# Altium schematic sheet SFP.SchDoc: Metlino
size 420 x 297 mm; CheckedBy: P.Kulik,T.Przywozki,W.Ruclo; Author: G.Kasprowicz; CompanyName: WUT ISE; DrawnBy: G.Kasprowicz; Organization: WUT ISE; Address1: PW ISE; Address2: Nowowiejska 15/19 00-665 Warsaw; Address3: gkasprow@gmail.com; DocumentNumber: 16; Revision: 2; SheetNumber: 16; SheetTotal: 29; ModifiedBy: -; CheckedDate: -; Title2: SFP; DivGrp: WUT ISE; Designer: G.Kasprowicz; ModifiedDate: -; ProjectName: Sensor Box
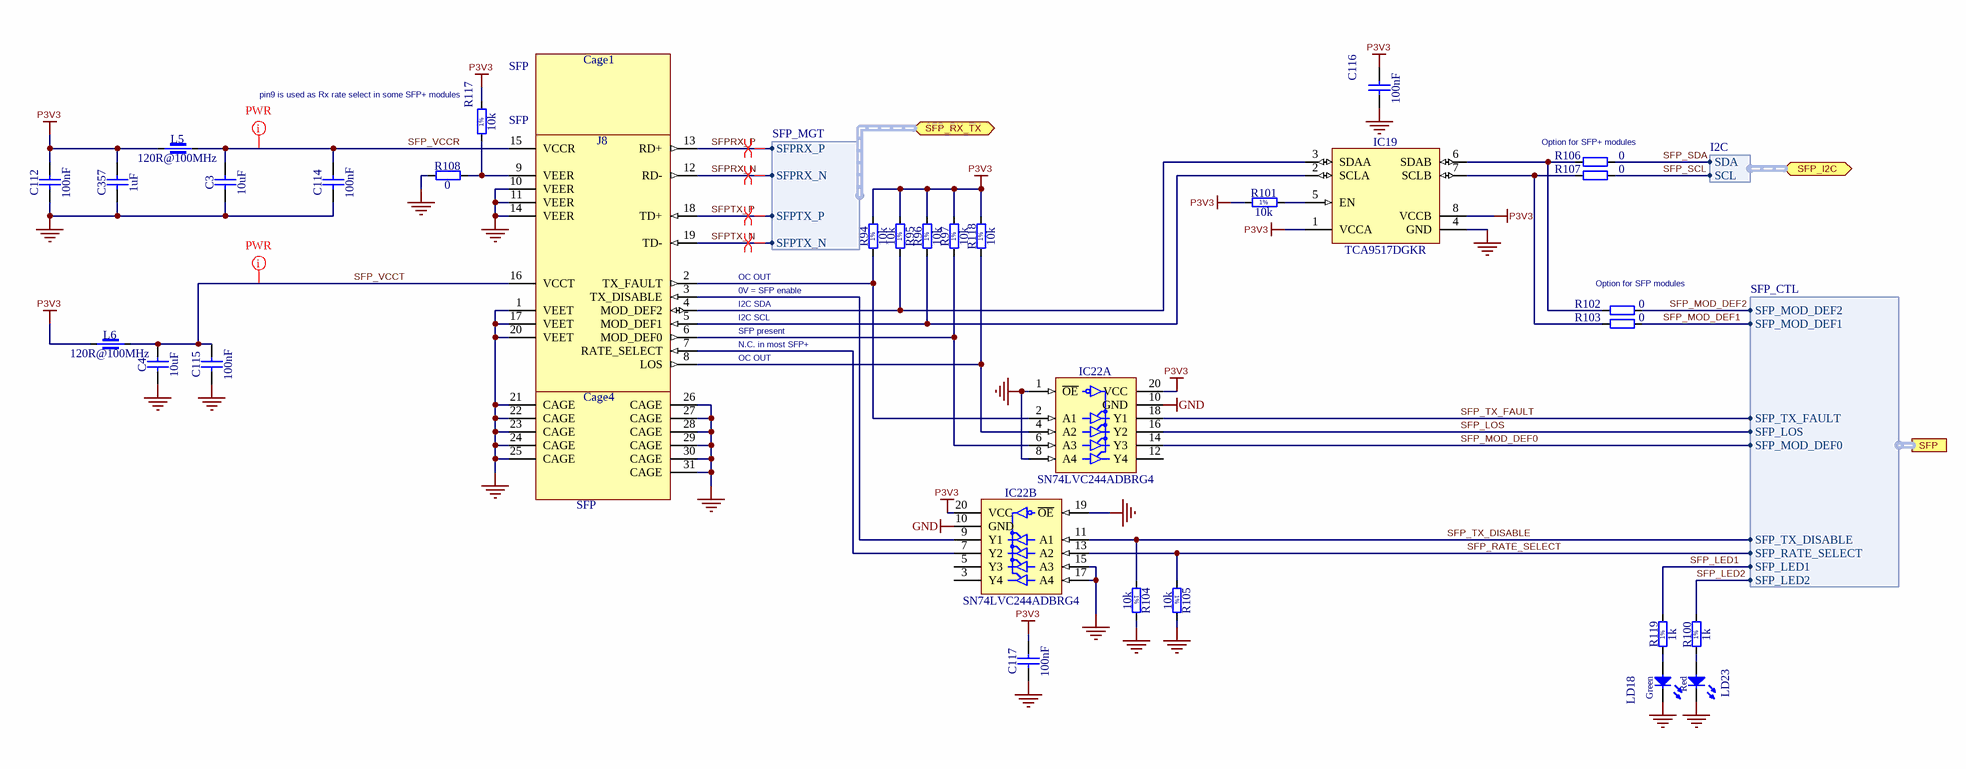
[diagram p0: SFP.SchDoc]

## Parts
C3  10uF  [CAPC1608X87N]
C4  10uF  [CAPC1608X87N]
C112  100nF  [CAPC0603X33N]
C114  100nF  [CAPC0603X33N]
C115  100nF  [CAPC0603X33N]
C116  100nF  [CAPC0603X33N]
C117  100nF  [CAPC0603X33N]
C357  1uF  [CAPC1005X55N]
Cage1  SFP  [TYCO_6367035-1]
Cage4  SFP  [TYCO_6367034-1]
IC19  TCA9517DGKR  [SOP65P490X110-8N]
IC22  SN74LVC244ADBRG4  [SOP65P780X200-20N]  (parts A,B of 2)
J8  SFP  [TYCO_1367073-1]
L5  120R@100MHz  [INDC1608X65N]
L6  120R@100MHz  [INDC1608X65N]
LD18  Green  [LED_AVAGO_HSME-C120]
LD23  Red  [LED_AVAGO_HSMC-C120]
R94  10k  [RESC1005X40N]
R95  10k  [RESC1005X40N]
R96  10k  [RESC1005X40N]
R97  10k  [RESC1005X40N]
R100  1k  [RESC1005X40N]
R101  10k  [RESC1005X40N]
R102  0  [RESC1005X40N]
R103  0  [RESC1005X40N]
R104  10k  [RESC1005X40N]
R105  10k  [RESC1005X40N]
R106  0  [RESC1005X40N]
R107  0  [RESC1005X40N]
R108  0  [RESC1005X40N]
R117  10k  [RESC1005X40N]
R118  10k  [RESC1005X40N]
R119  1k  [RESC1005X40N]

## Ports
SFP (harness SFP_CTL), SFP_I2C (bidir, harness I2C), SFP_RX_TX (bidir, harness SFP_MGT)

## Harnesses
SFP_MGT: SFPRX_P, SFPRX_N, SFPTX_P, SFPTX_N
SFP_CTL: SFP_MOD_DEF2, SFP_MOD_DEF1, SFP_TX_FAULT, SFP_LOS, SFP_MOD_DEF0, SFP_TX_DISABLE, SFP_RATE_SELECT, SFP_LED1, SFP_LED2
I2C: SCL, SDA

## Nets
GND: C3.1 C4.1 C112.1 C114.1 C115.1 C116.1 C117.1 C357.1 Cage4.21(CAGE) Cage4.22(CAGE) Cage4.23(CAGE) Cage4.24(CAGE) Cage4.25(CAGE) Cage4.26(CAGE) Cage4.27(CAGE) Cage4.28(CAGE) Cage4.29(CAGE) Cage4.30(CAGE) Cage4.31(CAGE) IC19.4(GND) IC22.1(~{OE}) IC22.8(A4) IC22.10(GND) IC22.15(A3) IC22.17(A4) IC22.19(~{OE}) J8.1(VEET) J8.10(VEER) J8.11(VEER) J8.14(VEER) J8.17(VEET) J8.20(VEET) LD18.1(C) LD23.1(C) R104.2 R105.2 R108.1
P3V3: C112.2 C116.2 C117.2 C357.2 IC19.1(VCCA) IC19.8(VCCB) IC22.20(VCC) L5.1 L6.1 R94.2 R95.2 R96.2 R97.2 R101.1 R117.2 R118.2
SFP_LED1: R119.2 ; port SFP.SFP_LED1
SFP_LED2: R100.2 ; port SFP.SFP_LED2
SFP_LOS: IC22.16(Y2) ; port SFP.SFP_LOS
SFP_MOD_DEF0: IC22.14(Y3) ; port SFP.SFP_MOD_DEF0
SFP_MOD_DEF1: R103.2 ; port SFP.SFP_MOD_DEF1
SFP_MOD_DEF2: R102.2 ; port SFP.SFP_MOD_DEF2
SFP_RATE_SELECT: IC22.13(A2) R105.1 ; port SFP.SFP_RATE_SELECT
SFP_SCL: R107.2 ; port SFP_I2C.SCL
SFP_SDA: R106.2 ; port SFP_I2C.SDA
SFP_TX_DISABLE: IC22.11(A1) R104.1 ; port SFP.SFP_TX_DISABLE
SFP_TX_FAULT: IC22.18(Y1) ; port SFP.SFP_TX_FAULT
SFP_VCCR: C3.2 C114.2 J8.15(VCCR) L5.2
SFP_VCCT: C4.2 C115.2 J8.16(VCCT) L6.2
SFPRX_N: J8.12(RD-) ; port SFP_RX_TX.SFPRX_N
SFPRX_P: J8.13(RD+) ; port SFP_RX_TX.SFPRX_P
SFPTX_N: J8.19(TD-) ; port SFP_RX_TX.SFPTX_N
SFPTX_P: J8.18(TD+) ; port SFP_RX_TX.SFPTX_P
NetIC19_2: IC19.2(SCLA) J8.5(MOD_DEF1) R96.1
NetIC19_3: IC19.3(SDAA) J8.4(MOD_DEF2) R95.1
NetIC19_5: IC19.5(EN) R101.2
NetIC19_6: IC19.6(SDAB) R102.1 R106.1
NetIC19_7: IC19.7(SCLB) R103.1 R107.1
NetIC22_2: IC22.2(A1) J8.2(TX_FAULT) R94.1
NetIC22_4: IC22.4(A2) J8.8(LOS) R118.1
NetIC22_6: IC22.6(A3) J8.6(MOD_DEF0) R97.1
NetIC22_7: IC22.7(Y2) J8.7(RATE_SELECT)
NetIC22_9: IC22.9(Y1) J8.3(TX_DISABLE)
NetJ8_9: J8.9(VEER) R108.2 R117.1
NetLD18_2: LD18.2(A) R119.1
NetLD23_2: LD23.2(A) R100.1

Not connected (* = marked no-connect by the designer): IC22 3(Y4) 5(Y3) 12(Y4)

## Layout directives
net class PWR: SFP_VCCR, SFP_VCCT
differential pair: SFPRX_N, SFPRX_P, SFPTX_N, SFPTX_P

## Notes on the sheet
- (near R117) pin9 is used as Rx rate select in some SFP+ modules
- (near R106) Option for SFP+ modules
- OC OUT
- Option for SFP modules
- N.C. in most SFP+
- SFP present
- I2C SCL
- I2C SDA
- 0V = SFP enable
- Project/Equipment
- Document
- Designer
- Drawn by
- Check.by
- Copyright WUT ISE 2018.
  This documentation describes Open Hardware and is licensed under the CERN OHL v.1.1. You may redistribute and modify this documentation under the terms of the CERN OHL v.1.1. (http://ohwr.org/CERNOHL). This documentation is distributed WITHOUT ANY EXPRESS OR IMPLIED WARRANTY, INCLUDING OF MERCHANTABILITY, SATISFACTORY QUALITY AND FITNESS FOR A PARTICULAR PURPOSE. Please see the CERN OHL v.1.1 for applicable conditions.
- Contact
- File
- Last Mod.
- Print Date
- Sheet
- Size
- A3
- of
- Rev
- (in symbol R0402_1K_1%_0.0625W_100PPM) 1%
- (in symbol R0402_10K_1%_0.0625W_100PPM) 1%

## Library data of the parts
C3 C4 = CC0603_10UF_6.3V_20%_X5R: Non-polarised capacitor; Manufacturer: GENERIC; Part Description: SMD Multilayer Chip Ceramic Capacitor; Manufacturer1 Part Number: C0603C106M9PAC; Tolerance: ±20%; Voltage: 6.3V; TC: X5R; Manufacturer Part Number: CC0603_10uF_6.3V_20%_X5R; Part Number: CC0603_10UF_6.3V_20%_X5R; Value: 10uF; Component Kind: Standard; Component Type: Standard; Pin Count: 2; Status: Preferred; Case: 0603; Mounted: Yes; Socket: No; SMD: Yes; Sense: No; Manufacturer1 Example: KEMET; Manufacturer1 ComponentHeight: 0.95mm; HelpURL: \\cern.ch\dfs\Applications\Altium\Datasheets\CC0603_X5R_KEMET.pdf; Author: CERN DEM JLC; CreateDate: 03.12.2007; LatestRevisionDate: 03.12.2007
C112 C114-C117 = CC0201_100NF_6.3V_10%_X5R: Non-polarised capacitor; Manufacturer: GENERIC; Part Description: SMD Multilayer Chip Ceramic Capacitor; Manufacturer1 Part Number: 02016D104KAT2A; Tolerance: ±10%; Voltage: 6.3V; TC: X5R; Manufacturer Part Number: CC0201_100NF_6.3V_10%_X5R; Part Number: CC0201_100NF_6.3V_10%_X5R; Value: 100nF; Component Kind: Standard; Component Type: Standard; Pin Count: 2; Status: Not Recommended; Case: 0201; Mounted: Yes; Socket: No; SMD: Yes; Sense: No; Manufacturer1 Example: AVX; Manufacturer1 ComponentHeight: 0.33mm; HelpURL: \\cern.ch\dfs\Applications\Altium\Datasheets\CC0201_X5R_AVX.pdf; Author: CERN DEM JLC; CreateDate: 03.12.2007; LatestRevisionDate: 03.12.2007
C357 = CC0402_1UF_16V_10%_X5R: Non-polarised capacitor; Manufacturer: GENERIC; Part Description: SMD Multilayer Chip Ceramic Capacitor; Manufacturer1 Part Number: C1005X5R1C105KT; Tolerance: ±10%; Voltage: 16V; TC: X5R; Manufacturer Part Number: CC0402_1UF_16V_10%_X5R; Part Number: CC0402_1UF_16V_10%_X5R; Value: 1uF; Component Kind: Standard; Component Type: Standard; Pin Count: 2; Status: Preferred; Case: 0402; Mounted: Yes; Socket: No; SMD: Yes; Sense: No; Manufacturer1 Example: TDK; Manufacturer1 ComponentHeight: 0.55mm; HelpURL: \\cern.ch\dfs\Applications\Altium\Datasheets\CC0402_X5R_TDK_C.pdf; Author: CERN DEM JLC; CreateDate: 25.10.2012; LatestRevisionDate: 25.10.2012
Cage1 = TYCO_6367035-1: SFP  Cage Top (Small Form-factor Pluggable); Manufacturer: TYCO ELECTRONICS; Part Description: Cage Top For Single Port SFP  (Small Form-factor Pluggable); PressFit: No; Manufacturer Part Number: 6367035-1; Part Number: TYCO_6367035-1; Component Kind: Standard; Component Type: Standard; Pin Count: 0; Family: SFP; Mounted: Yes; Socket: No; SMD: No; Sense: No; Status: None; ComponentHeight: 10mm; ComponentLink1URL: \\cern.ch\dfs\Applications\Altium\Datasheets\TYCO_SFP_Application.pdf; ComponentLink1Description: Application; ComponentLink2URL: \\cern.ch\dfs\Applications\Altium\Datasheets\Tyco_SFP_Specification.pdf; ComponentLink2Description: SFP Specification; HelpURL: \\cern.ch\dfs\Applications\Altium\Datasheets\TYCO_6367035-1.pdf; Author: CERN DEM JLC; CreateDate: 25.01.2010; LatestRevisionDate: 25.01.2010
Cage4 = TYCO_6367034-1: SFP  Cage Bottom (Small Form-factor Pluggable); Manufacturer: TYCO ELECTRONICS; Part Description: Cage bottom For Single Port SFP  (Small Form-factor Pluggable); PressFit: No; Manufacturer Part Number: 6367034-1; Part Number: TYCO_6367034-1; Component Kind: Standard; Component Type: Standard; Pin Count: 11; Family: SFP; Mounted: Yes; Socket: No; SMD: No; Sense: No; Status: None; ComponentHeight: 8.8mm; ComponentLink1URL: \\cern.ch\dfs\Applications\Altium\Datasheets\TYCO_SFP_Application.pdf; ComponentLink1Description: Application; ComponentLink2URL: \\cern.ch\dfs\Applications\Altium\Datasheets\Tyco_SFP_Specification.pdf; ComponentLink2Description: SFP Specification; HelpURL: \\cern.ch\dfs\Applications\Altium\Datasheets\TYCO_6367034-1.pdf; Author: CERN DEM JLC; CreateDate: 25.01.2010; LatestRevisionDate: 25.01.2010
IC19 = TCA9517DGKR: Level-Translating I2C Bus Repeater; Manufacturer: TEXAS INSTRUMENTS; PressFit: No; Bonding: No; Manufacturer Part Number: TCA9517DGKR; PackageDescription: SOP, 0.65mm, Pitch; 8 Pin, 3.0mm W X 3.0mm L X 1.10mm H Body, IPC Medium Density; Part Description: Level-Translating I2C Bus Repeater; Part Number: TCA9517DGKR; Component Kind: Standard; Component Type: Standard; Device: TCA9517DGKR; Pin Count: 8; Case: TSSOP8; Mounted: Yes; Socket: No; SMD: Yes; Sense: No; ComponentHeight: 1.1mm; Author: CERN DEM JLC; HelpURL: \\cern.ch\dfs\Applications\Altium\Datasheets\TCA9517DGKR.pdf; CreateDate: 07.07.2014; LatestRevisionDate: 07.07.2014
IC22 = SN74LVC244ADBRG4: Octal Buffer/Driver with 3-State Ouputs; Manufacturer: TEXAS INSTRUMENTS; Part Description: Octal Buffer/Driver with 3-State Outputs; PressFit: No; Bonding: No; Manufacturer Part Number: SN74LVC244ADBRG4; PackageDescription: SOP, 0.65mm Pitch; 20 pin, 5.30mm W X 7.20mm L X 2.00mm H body, IPC Medium Density; Part Number: SN74LVC244ADBRG4; Component Kind: Standard; Component Type: Standard; Device: SN74LVC244ADBRG4; Pin Count: 20; Case: TSSOP20; Mounted: Yes; Socket: No; SMD: Yes; Sense: No; ComponentHeight: 2mm; Author: CERN DEM JMW; HelpURL: \\cern.ch\dfs\Applications\Altium\Datasheets\SN74LVC244ADBRG4.pdf; CreateDate: 20.12.2010; LatestRevisionDate: 20.12.2010
J8 = TYCO_1367073-1: 20 Position SFP  Connector (Small Form-factor Pluggable); Manufacturer: TYCO ELECTRONICS; Part Description: 20 Position, Pitch 0.8mm SFP Receptacle (Small Form-factor Pluggable); PressFit: No; Manufacturer Part Number: 1367073-1; Part Number: TYCO_1367073-1; Component Kind: Standard; Component Type: Standard; Pin Count: 20; Family: SFP; Mounted: Yes; Socket: No; SMD: Yes; Sense: No; Status: None; ComponentHeight: 5.4mm; ComponentLink1URL: \\cern.ch\dfs\Applications\Altium\Datasheets\TYCO_SFP_Application.pdf; ComponentLink1Description: Application; ComponentLink2URL: \\cern.ch\dfs\Applications\Altium\Datasheets\Tyco_SFP_Specification.pdf; ComponentLink2Description: SFP Specification; HelpURL: \\cern.ch\dfs\Applications\Altium\Datasheets\TYCO_1367073-1.pdf; Author: CERN DEM JLC; CreateDate: 25.01.2010; LatestRevisionDate: 25.01.2010
L5 L6 = IND0603_MURATA_BLM18SG121TN1D: Manufacturer: MURATA; Part Description: SMD EMIFIL Suppression Chip Ferrite Bead; Tolerance: ±25%; Power: 3A; Resistance: 0.025R; Manufacturer Part Number: BLM18SG121TN1D; Part Number: IND0603_MURATA_BLM18SG121TN1D; Value: 120R@100MHz; Component Kind: Standard; Component Type: Standard; Pin Count: 2; Status: None; Case: 0603; Mounted: Yes; Socket: No; SMD: Yes; Sense: No; ComponentHeight: 0.65mm; HelpURL: \\cern.ch\dfs\Applications\Altium\Datasheets\IND0603_MURATA_BLM18S.pdf; Author: CERN DEM JLC; CreateDate: 23.07.2014; LatestRevisionDate: 25.10.2018
LD18 = LED_AVAGO_HSME-C120: LED Green 1C 2A; Manufacturer: AVAGO TECHNOLOGIES; Part Description: High Performance Right Angle Chip Green LED; PressFit: No; Bonding: No; Manufacturer Part Number: HSME-C120; PackageDescription: Green Chip LED, 2-Leads, Body 1.7x1.1mm, Side Emitting Package; Part Number: LED_AVAGO_HSME-C120; Component Kind: Standard; Component Type: Standard; Color: Green; Pin Count: 2; Mounted: Yes; Socket: No; SMD: Yes; Sense: No; ComponentHeight: 0.7mm; HelpURL: \\cern.ch\dfs\Applications\Altium\Datasheets\LED_AVAGO_HSME-C120.pdf; ComponentLink1URL: \\cern.ch\dfs\Applications\Altium\Datasheets\LED_AVAGO_HSME-C110_DESIGN-GUIDE.pdf; ComponentLink1Description: Design Guide; Author: CERN DEM JMW; CreateDate: 22.07.2009; LatestRevisionDate: 20.06.2012
LD23 = LED_AVAGO_HSMC-C120: LED Red 1C 2A; Manufacturer: AVAGO TECHNOLOGIES; Part Description: High Performance Right Angle Chip Red LED; PressFit: No; Bonding: No; Manufacturer Part Number: HSMC-C120; PackageDescription: Red Chip LED, 2-Leads, Body 1.7x1.1mm, Side Emitting Package; Part Number: LED_AVAGO_HSMC-C120; Component Kind: Standard; Component Type: Standard; Color: Red; Pin Count: 2; Mounted: Yes; Socket: No; SMD: Yes; Sense: No; ComponentHeight: 0.7mm; HelpURL: \\cern.ch\dfs\Applications\Altium\Datasheets\LED_AVAGO_HSMC-C120.pdf; ComponentLink1URL: \\cern.ch\dfs\Applications\Altium\Datasheets\LED_AVAGO_HSMC-C120_DESIGN-GUIDE.pdf; ComponentLink1Description: Design Guide; Author: CERN DEM JMW; CreateDate: 22.07.2009; LatestRevisionDate: 20.06.2012
R94-R97 R101 R104 R105 R117 R118 = R0402_10K_1%_0.0625W_100PPM: Resistor - 1%; Manufacturer: GENERIC; Part Description: General Purpose Thick Film Chip Resistor; Manufacturer1 Part Number: 232270671003L; TC: ±100ppm/°C; PressFit: No; Manufacturer Part Number: R0402_10K_1%_0.0625W_100PPM; Part Number: R0402_10K_1%_0.0625W_100PPM; Tolerance: ±1%; Value: 10k; Component Kind: Standard; Component Type: Standard; Pin Count: 2; Status: Not Recommended; Power: 0.0625W; Case: 0402; Mounted: Yes; Sense: No; Socket: No; SMD: Yes; Manufacturer1 Example: YAGEO PHYCOMP; Manufacturer1 ComponentHeight: 0.4mm; HelpURL: \\cern.ch\dfs\Applications\Altium\Datasheets\R0402_Phycomp_RC0402.pdf; Author: CERN DEM JLC; CreateDate: 03.12.2007; LatestRevisionDate: 17.10.2012
R100 R119 = R0402_1K_1%_0.0625W_100PPM: Resistor - 1%; Manufacturer: GENERIC; Part Description: General Purpose Thick Film Chip Resistor; Manufacturer1 Part Number: 232270671002L; TC: ±100ppm/°C; PressFit: No; Manufacturer Part Number: R0402_1K_1%_0.0625W_100PPM; Part Number: R0402_1K_1%_0.0625W_100PPM; Tolerance: ±1%; Value: 1k; Component Kind: Standard; Component Type: Standard; Pin Count: 2; Status: Not Recommended; Power: 0.0625W; Case: 0402; Mounted: Yes; Sense: No; Socket: No; SMD: Yes; Manufacturer1 Example: YAGEO PHYCOMP; Manufacturer1 ComponentHeight: 0.4mm; HelpURL: \\cern.ch\dfs\Applications\Altium\Datasheets\R0402_Phycomp_RC0402.pdf; Author: CERN DEM JLC; CreateDate: 03.12.2007; LatestRevisionDate: 17.10.2012
R102 R103 R106-R108 = R0402_0R_JUMPER: Resistor; Manufacturer: GENERIC; Part Description: 1A (0.05R Max DC Resistance) Zero Ohm Jumper; Manufacturer1 Part Number: 232270591001L; PressFit: No; Manufacturer Part Number: R0402_0R_JUMPER; Part Number: R0402_0R_JUMPER; Value: 0; Component Kind: Standard; Component Type: Standard; Pin Count: 2; Status: Not Recommended; Case: 0402; Mounted: Yes; Sense: No; Socket: No; SMD: Yes; Manufacturer1 Example: YAGEO PHYCOMP; Manufacturer1 ComponentHeight: 0.4mm; HelpURL: \\cern.ch\dfs\Applications\Altium\Datasheets\R0402_Phycomp_RC0402.pdf; Author: CERN DEM JLC; CreateDate: 03.12.2007; LatestRevisionDate: 17.10.2012